# EAGLE design RunnersHighEA_HALL (EAGLE 9.5.1)
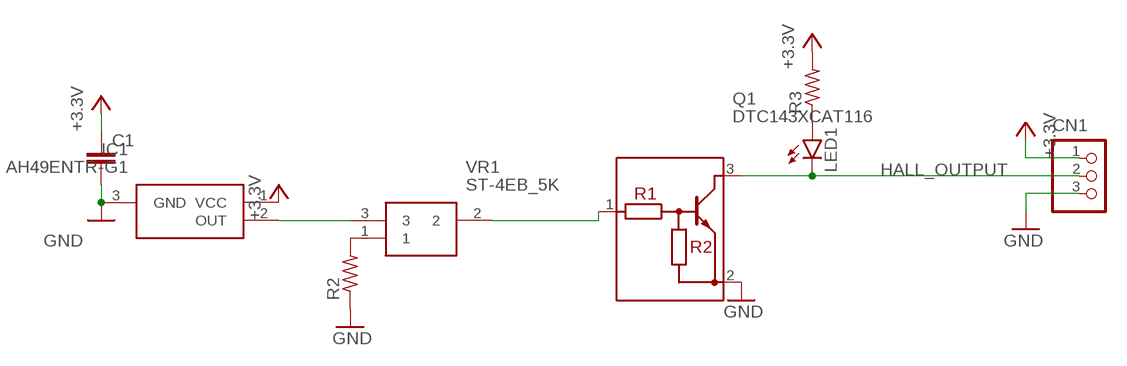
[diagram p0: schematic, sheet 1]

## Parts
C1  C-EUC0603  [C0603]
CN1  S3B-PH-SM4-TB  [S3B-PH-SM4-TB]
IC1  AH49ENTR-G1  [SOT95P280X145-3N]
LED1  LEDCHIP-LED0603  [CHIP-LED0603]
Q1  DTC143XCAT116  [SOT85P240X115-3N]
R2  R-US_R0603  [R0603]
R3  R-US_R0603  [R0603]
VR1  ST-4EB_5K  [ST-4EB]

## Nets
+3.3V: C1.1 CN1.1 IC1.1(VCC) R3.2
GND: C1.2 CN1.3 IC1.3(GND) Q1.2(E) R2.1
HALL_OUTPUT: CN1.2 LED1.C Q1.3(C)
N$1: R2.2 VR1.1
N$2: IC1.2(OUT) VR1.3
N$3: Q1.1(B) VR1.2
N$4: LED1.A R3.1

## Library data of the parts
C1 = rcl:C-EU: CAPACITOR, European symbol; SPICEPREFIX: C
CN1 = jst-ph:S3B-PH-*: Wire-to-Board 2.0mm pitch side mount connector Source: http://www.jst-mfg.com/product/pdf/jpn/PH.pdf http://www.jst-mfg.com/product/detail.php?series=199
IC1 = SamacSys_Parts:AH49ENTR-G1: DiodesZetex AH49ENTR-G1, Linear Hall Effect Sensor Switch 3-Pin SOT-23, 3 6.5 V Source: Datasheet <https://www.diodes.com/assets/Datasheets/AH49E.pdf>; ALLIED_NUMBER: 70550958; ALLIED_PRICE-STOCK: https://www.alliedelec.com/diodesinc-ah49entr-g1/70550958/; DESCRIPTION: DiodesZetex AH49ENTR-G1, Linear Hall Effect Sensor Switch 3-Pin SOT-23, 3 6.5 V; HEIGHT: 1.45mm; MANUFACTURER_NAME: Diodes Inc.; MANUFACTURER_PART_NUMBER: AH49ENTR-G1; MOUSER_PART_NUMBER: 621-AH49ENTR-G1; MOUSER_PRICE-STOCK: https://www.mouser.com/Search/Refine.aspx?Keyword=621-AH49ENTR-G1; RS_PART_NUMBER: 9210332P; RS_PRICE-STOCK: http://uk.rs-online.com/web/p/products/9210332P
LED1 = led:LED: LED OSRAM: - CHIPLED LG R971, LG N971, LY N971, LG Q971, LY Q971, LO R971, LY R971 LH N974, LH R974 LS Q976, LO Q976, LY Q976 LO Q996 - Hyper CHIPLED LW Q18S LB Q993, LB Q99A, LB R99A - SideLED LS A670, LO A670, LY A670, LG A670, LP A670 LB A673, LV A673, LT A673, LW A673 LH A674 LY A675 LS A676, LA A676, LO A676, LY A676, LW A676 LS A679, LY A679, LG A679 - Hyper Micro SIDELED® LS Y876, LA Y876, LO Y876, LY Y876 LT Y87S - SmartLED LW L88C, LW L88S LB L89C, LB L89S, LG L890 LS L89K, LO L89K, LY L89K LS L896, LA L896, LO L896, LY L896 - TOPLED LS T670, LO T670, LY T670, LG T670, LP T670 LSG T670, LSP T670, LSY T670, LOP T670, LYG T670 LG T671, LOG T671, LSG T671 LB T673, LV T673, LT T673, LW T673 LH T674 LS T676, LA T676, LO T676, LY T676, LB T676, LH T676, LSB T676, LW T676 LB T67C, LV T67C, LT T67C, LS T67K, LO T67K, LY T67K, LW E67C LS E67B, LA E67B, LO E67B, LY E67B, LB E67C, LV E67C, LT E67C LW T67C LS T679, LY T679, LG T679 LS T770, LO T770, LY T770, LG T770, LP T770 LB T773, LV T773, LT T773, LW T773 LH T774 LS E675, LA E675, LY E675, LS T675 LS T776, LA T776, LO T776, LY T776, LB T776 LHGB T686 LT T68C, LB T68C - Hyper Mini TOPLED® LB M676 - Mini TOPLED Santana® LG M470 LS M47K, LO M47K, LY M47K Source: http://www.osram.convergy.de LUXEON: - LUMILED® LXK2-PW12-R00, LXK2-PW12-S00, LXK2-PW14-U00, LXK2-PW14-V00 LXK2-PM12-R00, LXK2-PM12-S00, LXK2-PM14-U00 LXK2-PE12-Q00, LXK2-PE12-R00, LXK2-PE12-S00, LXK2-PE14-T00, LXK2-PE14-U00 LXK2-PB12-K00, LXK2-PB12-L00, LXK2-PB12-M00, LXK2-PB14-N00, LXK2-PB14-P00, LXK2-PB14-Q00 LXK2-PR12-L00, LXK2-PR12-M00, LXK2-PR14-Q00, LXK2-PR14-R00 LXK2-PD12-Q00, LXK2-PD12-R00, LXK2-PD12-S00 LXK2-PH12-R00, LXK2-PH12-S00 LXK2-PL12-P00, LXK2-PL12-Q00, LXK2-PL12-R00 Source: www.luxeon.com KINGBRIGHT: KA-3528ASYC Source: www.kingbright.com
Q1 = DTC143XCAT116:DTC143XCAT116: ROHM, DTC143XCAT116 NPN Digital Transistor, 100 mA 50 V 4.7 k, Ratio Of 2.1, Single, 3-Pin SOT-23 Source: Datasheet <https://docs.rs-online.com/402a/0900766b81565517.pdf>; DESCRIPTION: ROHM, DTC143XCAT116 NPN Digital Transistor, 100 mA 50 V 4.7 k<ohm/>, Ratio Of 2.1, Single, 3-Pin SOT-23; HEIGHT: 1.15mm; MANUFACTURER_NAME: ROHM Semiconductor; MANUFACTURER_PART_NUMBER: DTC143XCAT116
R2 R3 = rcl:R-US_: RESISTOR, American symbol; SPICEPREFIX: R
VR1 = SamacSys_Parts:ST-4EB_5K: Surface Mount Cermet Trimmers (single turn) Source: Datasheet <http://docs-asia.electrocomponents.com/webdocs/0635/0900766b806350ac.pdf>; DESCRIPTION: Surface Mount Cermet Trimmers (single turn); HEIGHT: mm; MANUFACTURER_NAME: Copal Electronics; MANUFACTURER_PART_NUMBER: ST-4EB 5k

## Board
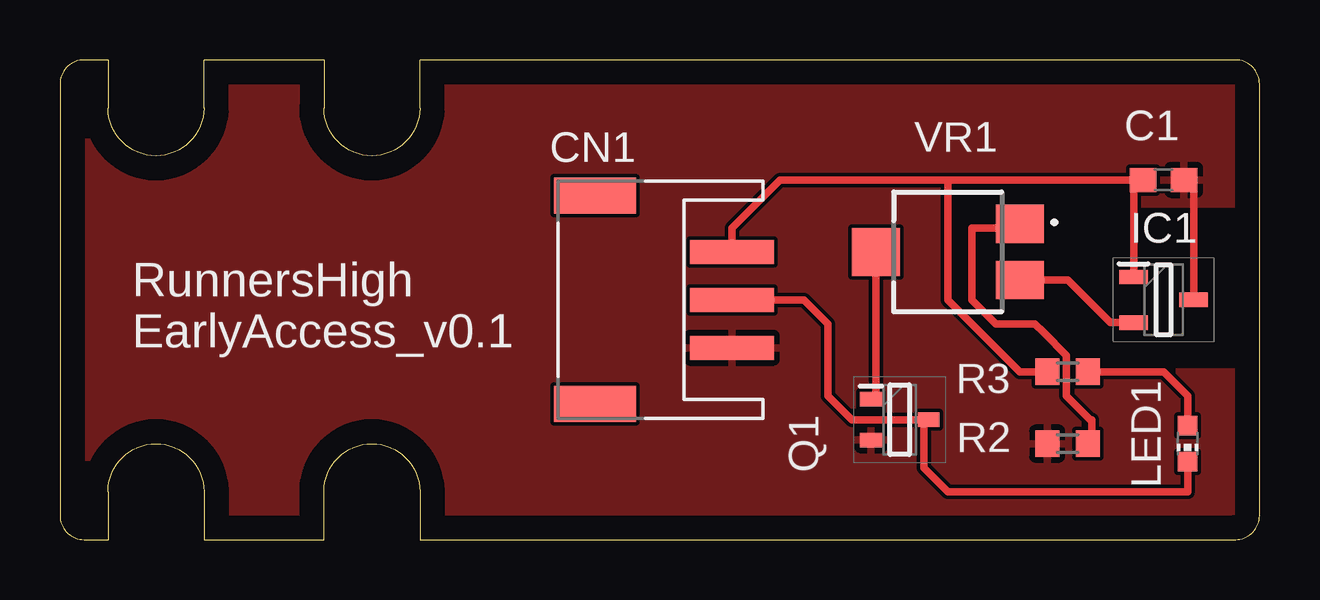
[diagram p1: board, top side]

Size 50 x 20 mm. Coordinates in mm from the lower left corner, seen from the top.
Outline: 0,19 0,1 arc90 1,0 2,0 2,2 arc-180 6,2 6,0 11,0 11,2 arc-180 15,2 15,0 49,0 arc90 50,1 50,19 arc90 49,20 15,20 15,18 arc-180 11,18 11,20 6,20 6,18 arc-180 2,18 2,20 1,20 arc90 0,19
Copper layers (1*16): Top 0.035mm / dielectric 1.5mm / Bottom 0.035mm
Design rules "default": minimum track width 6mil, minimum drill 0.35mm, track to track 6mil, track to pad 6mil, pad to pad 6mil, via to via 6mil, smd to smd 6mil, copper to edge 40mil, drill to drill 6mil, minimum pad ring 10mil, minimum via ring 8mil, stop-mask expansion 4mil, vias tented up to drill 0mil, thermal gap 10mil

### Footprints (pad centres in the part's own frame; a part is rotated, then mirrored left to right if it is on the bottom)
C0603 = smd 1.1 x 1: 1 -0.85,0; 2 0.85,0
S3B-PH-SM4-TB = smd 1 x 3.5: 1 2,-1; 2 0,-1; 3 -2,-1 | smd 1.5 x 3.4: S1 -4.35,4.7; S2 4.35,4.7
SOT95P280X145-3N = smd 1.2 x 0.6: 1 -1.25,0.95; 2 -1.25,-0.95; 3 1.25,0
CHIP-LED0603 = smd 0.8 x 0.8: A 0,-0.75; C 0,0.75
SOT85P240X115-3N = smd 0.9 x 0.6: 1 -1.2,0.85; 2 -1.2,-0.85; 3 1.2,0
R0603 = smd 1 x 1.1: 1 -0.85,0; 2 0.85,0
ST-4EB = smd 1.6 x 2: 1 1.175,-3; 3 -1.175,-3 | smd 2 x 2: 2 0,3

### Placement (x,y rotation side)
C1  46,15 0 top
CN1  27,10 90 top
IC1  46,10 0 top
LED1  47,4 180 top
Q1  35,5 0 top
R2  42,4 0 top
R3  42,7 180 top
VR1  37,12 90 top

### Tracks (layer width: path | path; a pad name or v marks a point on that pad's centre or on a via)
+3.3V
  Top 0.305: 37,15 C1.1 44.75,14.6 IC1.1 44.8,11 | 37,15 30,15 28,13 CN1.1 | 37,15 37,10 40,7 R3.2
GND
  Top 0.305: IC1.3 47.25,14.6 C1.2
  pour Top: 0,20 50,20 50,14 44,14 44,7 50,7 50,0 0,0
HALL_OUTPUT
  Top 0.305: CN1.2 31,10 32,9 32,6 33,5 Q1.3 36,4.8 36,3 37,2 47,2 LED1.C
N$1
  Top 0.305: VR1.1 39.83,13 38,13 38,10 39,9 40.63,9 41,8.63 41.95,7.68 41.95,6 42.95,5 43,5 43,4.15 R2.2
N$2
  Top 0.305: VR1.3 42,10.82 43.77,9.05 IC1.2
N$3
  Top 0.305: VR1.2 34,6.05 Q1.1
N$4
  Top 0.305: LED1.A 47,6 46,7 R3.1

### Text on the board
tPlace: RunnersHigh / EarlyAccess_v0.1